# EAGLE design Osus-slave (EAGLE 5.11)
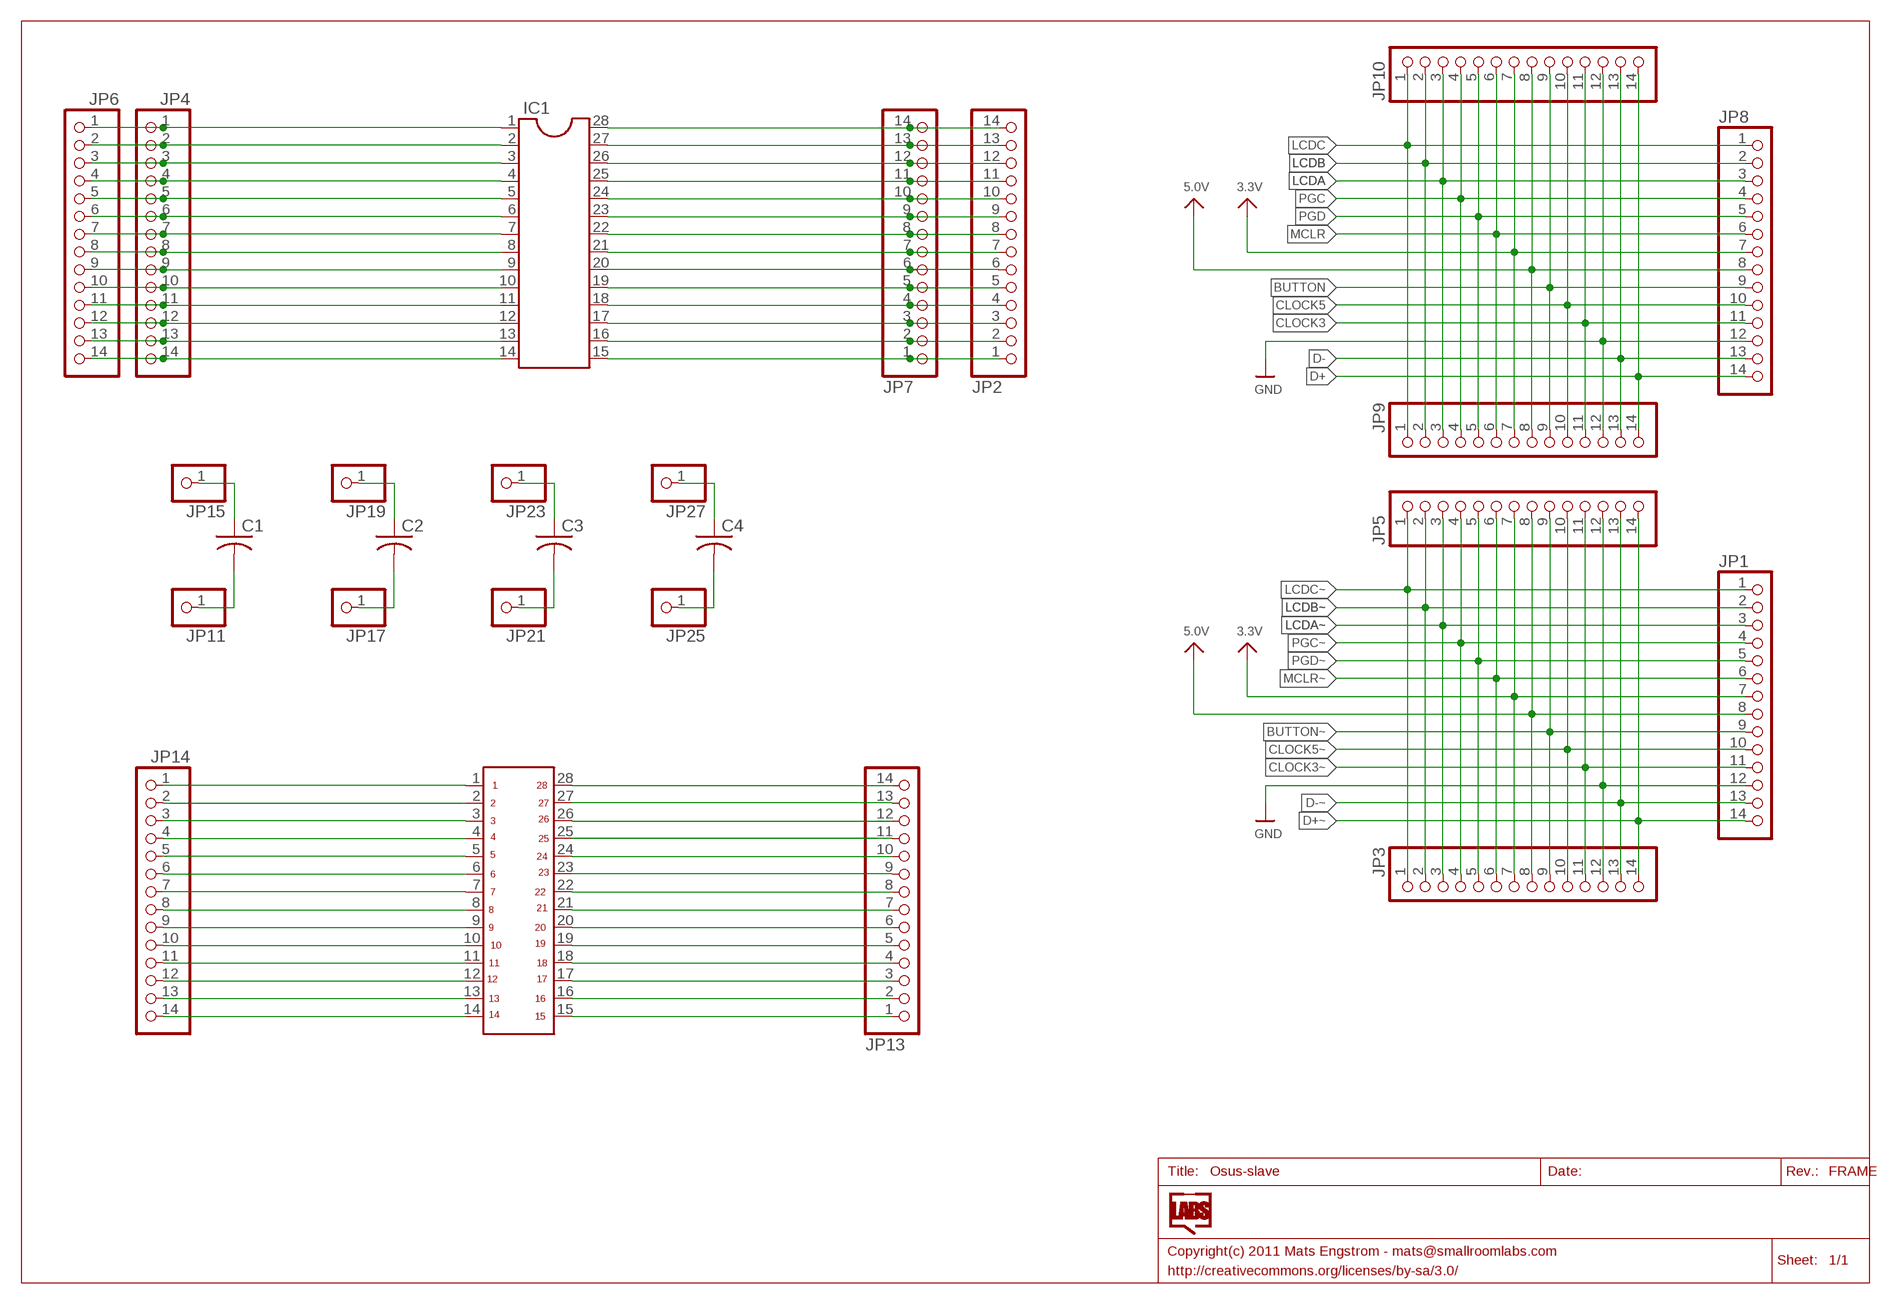
[diagram p0: schematic, sheet 1]

## Parts
C1  C-US050-025X075  [C050-025X075]
C2  C-US050-025X075  [C050-025X075]
C3  C-US050-025X075  [C050-025X075]
C4  C-US050-025X075  [C050-025X075]
IC1  DIL28-3  [DIL28-3]
JP1  PINHD-1X14  [1X14]
JP2  PINHD-1X14-CB  [1X14-CB]
JP3  PINHD-1X14-CB  [1X14-CB]
JP4  PINHD-1X14-CB  [1X14-CB]
JP5  PINHD-1X14-CB  [1X14-CB]
JP6  PINHD-1X14-CB  [1X14-CB]
JP7  PINHD-1X14-CB  [1X14-CB]
JP8  PINHD-1X14  [1X14]
JP9  PINHD-1X14-CB  [1X14-CB]
JP10  PINHD-1X14-CB  [1X14-CB]
JP11  PINHD-1X1  [1X01]
JP13  PINHD-1X14-CB  [1X14-CB]
JP14  PINHD-1X14-CB  [1X14-CB]
JP15  PINHD-1X1  [1X01]
JP17  PINHD-1X1  [1X01]
JP19  PINHD-1X1  [1X01]
JP21  PINHD-1X1  [1X01]
JP23  PINHD-1X1  [1X01]
JP25  PINHD-1X1  [1X01]
JP27  PINHD-1X1  [1X01]
U$6  IC28SOIC28-EXTRA  [SOIC127P1034X264-28N]

## Nets
3.3V: JP8.7 JP9.7 JP10.7
3.3V~: JP1.7 JP3.7 JP5.7 ; supply symbol labelled 3.3V
5.0V: JP8.8 JP9.8 JP10.8
5.0V~: JP1.8 JP3.8 JP5.8 ; supply symbol labelled 5.0V
BUTTON: JP8.9 JP9.9 JP10.9
BUTTON~: JP1.9 JP3.9 JP5.9
CLOCK3: JP8.11 JP9.11 JP10.11
CLOCK3~: JP1.11 JP3.11 JP5.11
CLOCK5: JP8.10 JP9.10 JP10.10
CLOCK5~: JP1.10 JP3.10 JP5.10
D+: JP8.14 JP9.14 JP10.14
D+~: JP1.14 JP3.14 JP5.14
D-: JP8.13 JP9.13 JP10.13
D-~: JP1.13 JP3.13 JP5.13
GND: JP8.12 JP9.12 JP10.12
GND~: JP1.12 JP3.12 JP5.12 ; supply symbol labelled GND
LCDA: JP8.3 JP9.3 JP10.3
LCDA~: JP1.3 JP3.3 JP5.3
LCDB: JP8.2 JP9.2 JP10.2
LCDB~: JP1.2 JP3.2 JP5.2
LCDC: JP8.1 JP9.1 JP10.1
LCDC~: JP1.1 JP3.1 JP5.1
MCLR: JP8.6 JP9.6 JP10.6
MCLR~: JP1.6 JP3.6 JP5.6
N$1: JP14.2 U$6.2
N$2: IC1.2 JP4.2 JP6.2
N$3: IC1.3 JP4.3 JP6.3
N$4: IC1.4 JP4.4 JP6.4
N$5: IC1.5 JP4.5 JP6.5
N$6: IC1.6 JP4.6 JP6.6
N$7: IC1.7 JP4.7 JP6.7
N$8: IC1.9 JP4.9 JP6.9
N$9: IC1.10 JP4.10 JP6.10
N$10: IC1.11 JP4.11 JP6.11
N$11: IC1.12 JP4.12 JP6.12
N$12: IC1.13 JP4.13 JP6.13
N$13: IC1.14 JP4.14 JP6.14
N$14: IC1.8 JP4.8 JP6.8
N$15: IC1.28 JP2.14 JP7.14
N$16: IC1.27 JP2.13 JP7.13
N$17: IC1.26 JP2.12 JP7.12
N$18: IC1.25 JP2.11 JP7.11
N$19: IC1.24 JP2.10 JP7.10
N$20: IC1.23 JP2.9 JP7.9
N$21: IC1.22 JP2.8 JP7.8
N$22: IC1.21 JP2.7 JP7.7
N$23: IC1.18 JP2.4 JP7.4
N$24: IC1.17 JP2.3 JP7.3
N$25: IC1.16 JP2.2 JP7.2
N$26: IC1.15 JP2.1 JP7.1
N$27: IC1.19 JP2.5 JP7.5
N$28: IC1.20 JP2.6 JP7.6
N$29: IC1.1 JP4.1 JP6.1
N$31: JP14.3 U$6.3
N$32: JP14.4 U$6.4
N$33: JP14.5 U$6.5
N$34: JP14.6 U$6.6
N$35: JP14.7 U$6.7
N$36: JP14.9 U$6.9
N$37: JP14.10 U$6.10
N$38: JP14.11 U$6.11
N$39: JP14.12 U$6.12
N$40: JP14.13 U$6.13
N$41: JP14.14 U$6.14
N$42: JP14.8 U$6.8
N$43: JP13.14 U$6.28
N$44: JP13.13 U$6.27
N$45: JP13.12 U$6.26
N$46: JP13.11 U$6.25
N$47: JP13.10 U$6.24
N$48: JP13.9 U$6.23
N$49: JP13.8 U$6.22
N$50: JP13.7 U$6.21
N$51: JP13.4 U$6.18
N$52: JP13.3 U$6.17
N$53: JP13.2 U$6.16
N$54: JP13.1 U$6.15
N$55: JP13.5 U$6.19
N$56: JP13.6 U$6.20
N$57: JP14.1 U$6.1
N$58: C1.1 JP15.1
N$59: C1.2 JP11.1
N$60: C2.1 JP19.1
N$61: C2.2 JP17.1
N$62: C3.1 JP23.1
N$63: C3.2 JP21.1
N$64: C4.1 JP27.1
N$65: C4.2 JP25.1
PGC: JP8.4 JP9.4 JP10.4
PGC~: JP1.4 JP3.4 JP5.4
PGD: JP8.5 JP9.5 JP10.5
PGD~: JP1.5 JP3.5 JP5.5

## Library data of the parts
C1-C4 = adafruit:C-US: CAPACITOR, American symbol
IC1 = ic-package:DIL28: Dual In Line
JP1 JP8 = pinhead:PINHD-1X14: PIN HEADER
JP2-JP7 JP9 JP10 JP13 JP14 = adafruit:PINHD-1X14: PIN HEADER
JP11 JP15 JP17 JP19 JP21 JP23 JP25 JP27 = adafruit:PINHD-1X1: Pin header 1x1 for 0.1" spacing With round pins
U$6 = SmallRoomLabs:IC28

## Net classes
0 default: width 0.203 mm, drill 0.305 mm, clearance 0.203 mm

## Board
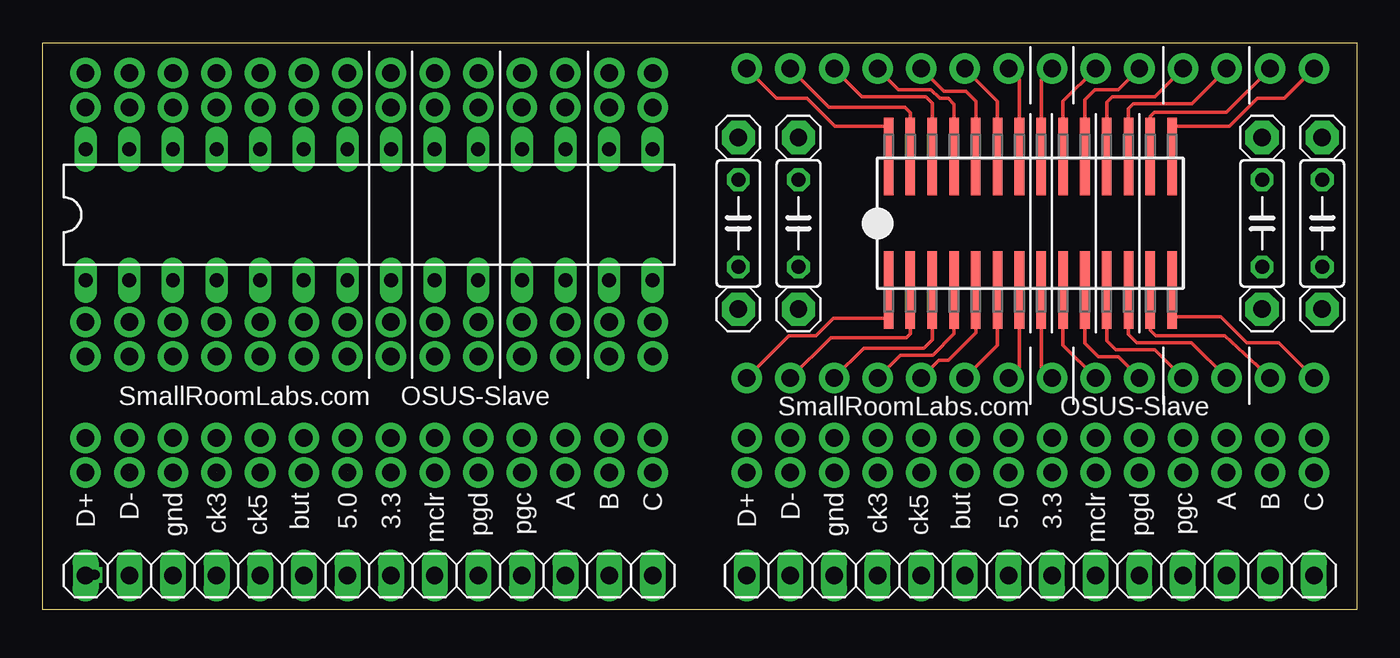
[diagram p1: board, top side]
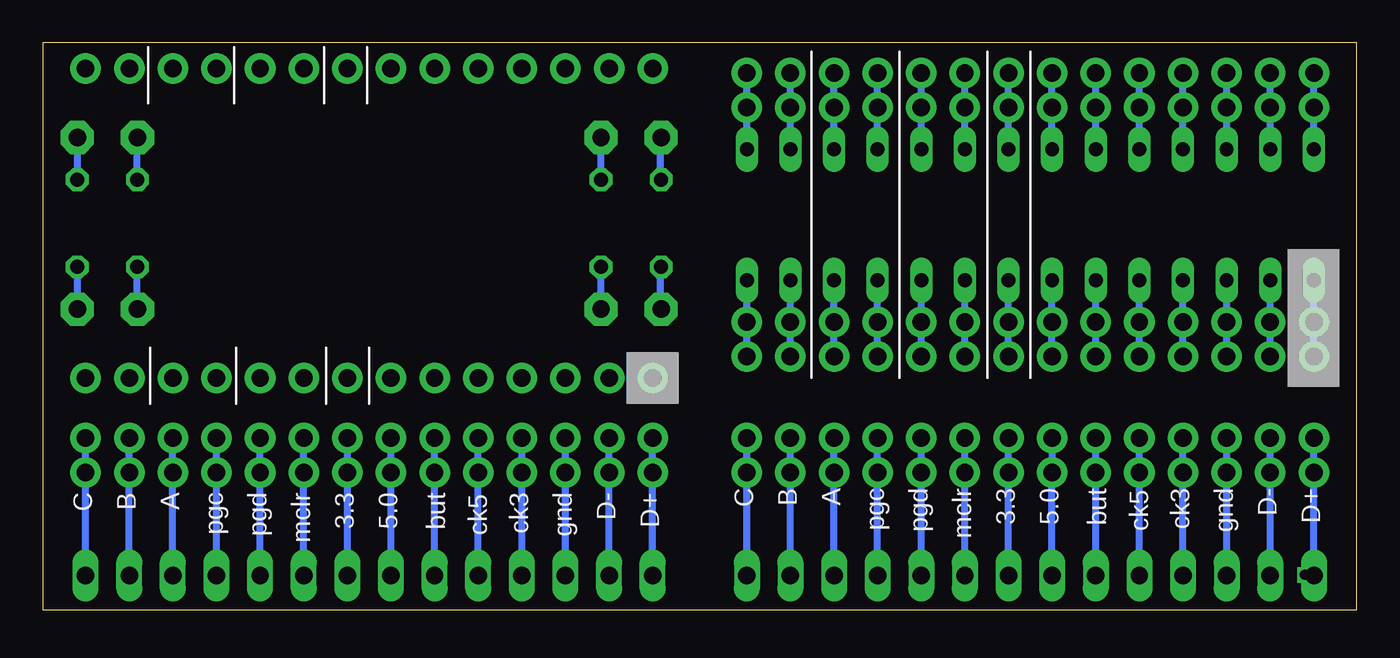
[diagram p2: board, bottom side, seen from below]

Size 76.5 x 33 mm. Coordinates in mm from the lower left corner, seen from the top.
Outline: 0,33 76.5,33 76.5,0 0,0 0,33
Copper layers (1*16): Top 0.035mm / dielectric 1.5mm / Bottom 0.035mm
Design rules "SmartPrototyping": minimum track width 7mil, minimum drill 12mil, track to track 7mil, track to pad 7mil, pad to pad 7mil, via to via 7mil, smd to smd 0mil, copper to edge 20mil, drill to drill 10mil, minimum pad ring 10mil, minimum via ring 6mil, stop-mask expansion 2mil, vias tented up to drill 25mil, thermal gap 10mil

### Footprints (pad centres in the part's own frame; a part is rotated, then mirrored left to right if it is on the bottom)
C050-025X075 = drill 0.813 octagon: 1 -2.54,0; 2 2.54,0
DIL28-3 = drill 0.813 long: 1 -16.51,-3.81; 2 -13.97,-3.81; 3 -11.43,-3.81; 4 -8.89,-3.81; 5 -6.35,-3.81; 6 -3.81,-3.81; 7 -1.27,-3.81; 8 1.27,-3.81; 9 3.81,-3.81; 10 6.35,-3.81; 11 8.89,-3.81; 12 11.43,-3.81; 13 13.97,-3.81; 14 16.51,-3.81; 15 16.51,3.81; 16 13.97,3.81; 17 11.43,3.81; 18 8.89,3.81; 19 6.35,3.81; 20 3.81,3.81; 21 1.27,3.81; 22 -1.27,3.81; 23 -3.81,3.81; 24 -6.35,3.81; 25 -8.89,3.81; 26 -11.43,3.81; 27 -13.97,3.81; 28 -16.51,3.81
1X14 = drill 1.016 long: 1 -16.51,0; 2 -13.97,0; 3 -11.43,0; 4 -8.89,0; 5 -6.35,0; 6 -3.81,0; 7 -1.27,0; 8 1.27,0; 9 3.81,0; 10 6.35,0; 11 8.89,0; 12 11.43,0; 13 13.97,0; 14 16.51,0
1X14-CB = drill 1.016 pad 1.778 round: 1 -16.51,0; 2 -13.97,0; 3 -11.43,0; 4 -8.89,0; 5 -6.35,0; 6 -3.81,0; 7 -1.27,0; 8 1.27,0; 9 3.81,0; 10 6.35,0; 11 8.89,0; 12 11.43,0; 13 13.97,0; 14 16.51,0
1X01 = drill 1.016 pad 1.93 octagon: 1 0,0
SOIC127P1034X264-28N = smd 4.521 x 0.559: 1 -3.886,8.255; 2 -3.886,6.985; 3 -3.886,5.715; 4 -3.886,4.445; 5 -3.886,3.175; 6 -3.886,1.905; 7 -3.886,0.635; 8 -3.886,-0.635; 9 -3.886,-1.905; 10 -3.886,-3.175; 11 -3.886,-4.445; 12 -3.886,-5.715; 13 -3.886,-6.985; 14 -3.886,-8.255; 15 3.886,-8.255; 16 3.886,-6.985; 17 3.886,-5.715; 18 3.886,-4.445; 19 3.886,-3.175; 20 3.886,-1.905; 21 3.886,-0.635; 22 3.886,0.635; 23 3.886,1.905; 24 3.886,3.175; 25 3.886,4.445; 26 3.886,5.715; 27 3.886,6.985; 28 3.886,8.255

### Placement (x,y rotation side)
C1  44,22.5 90 top
C2  40.5,22.5 90 top
C3  71,22.5 270 top
C4  74.5,22.5 90 top
IC1  19,23 0 top
JP1  19,2 180 top
JP2  19,29.25 180 top
JP3  19,10 180 top
JP4  19,14.75 0 top
JP5  19,8 180 top
JP6  19,16.75 0 top
JP7  19,31.25 180 top
JP8  57.5,2 0 top
JP9  57.5,8 0 top
JP10  57.5,10 0 top
JP11  44,27.5 0 top
JP13  57.5,31.5 180 top
JP14  57.5,13.5 0 top
JP15  44,17.5 0 top
JP17  40.5,27.5 0 top
JP19  40.5,17.5 0 top
JP21  71,17.5 0 top
JP23  71,27.5 0 top
JP25  74.5,27.5 0 top
JP27  74.5,17.5 0 top
U$6  57.5,22.5 90 top

### Tracks (layer width: path | path; a pad name or v marks a point on that pad's centre or on a via)
3.3V
  Bottom 0.406: JP10.7 JP9.7 JP8.7
3.3V~
  Bottom 0.406: JP1.7 JP5.7 JP3.7
5.0V
  Bottom 0.406: JP10.8 JP9.8 JP8.8
5.0V~  (via drill 0.6)  (1 unrouted)
  Bottom 0.406: JP3.8 JP5.8 JP1.8
  other vias: 17.73,8
BUTTON
  Bottom 0.406: JP10.9 JP9.9 JP8.9
BUTTON~
  Bottom 0.406: JP3.9 JP5.9 JP1.9
CLOCK3
  Bottom 0.406: JP10.11 JP9.11 JP8.11
CLOCK3~  (via drill 0.6)  (1 unrouted)
  Bottom 0.406: JP3.11 JP5.11 JP1.11
  other vias: 10.11,8
CLOCK5
  Bottom 0.406: JP10.10 JP9.10 JP8.10
CLOCK5~
  Bottom 0.406: JP1.10 JP5.10 JP3.10
D+
  Bottom 0.406: JP8.14 JP9.14 JP10.14
D+~  (via drill 0.6)
  Bottom 0.406: v3,2.04 3,2 JP1.14 JP5.14 JP3.14
D-
  Bottom 0.406: JP10.13 JP9.13 JP8.13
D-~  (via drill 0.6)  (1 unrouted)
  Bottom 0.406: JP3.13 JP5.13 JP1.13
  other vias: 5.03,8
GND
  Bottom 0.406: JP10.12 JP9.12 JP8.12
GND~
  Bottom 0.406: JP1.12 JP5.12 JP3.12
LCDA
  Bottom 0.406: JP10.3 JP9.3 JP8.3
LCDA~
  Bottom 0.406: JP3.3 JP5.3 JP1.3
LCDB
  Bottom 0.406: JP10.2 JP9.2 JP8.2
LCDB~
  Bottom 0.406: JP1.2 JP5.2 JP3.2
LCDC
  Bottom 0.406: JP10.1 JP9.1 JP8.1
LCDC~
  Bottom 0.406: JP3.1 JP5.1 JP1.1
MCLR
  Bottom 0.406: JP10.6 JP9.6 JP8.6
MCLR~
  Bottom 0.406: JP3.6 JP5.6 JP1.6
N$1
  Top 0.203: U$6.2 50.52,16.07 50.29,15.85 45.88,15.85 JP14.2
N$2
  Bottom 0.406: IC1.2 JP6.2 JP4.2
N$3
  Bottom 0.406: IC1.3 JP6.3 JP4.3
N$4
  Bottom 0.406: IC1.4 JP6.4 JP4.4
N$5
  Bottom 0.406: IC1.5 JP6.5 JP4.5
N$6
  Bottom 0.406: IC1.6 JP6.6 JP4.6
N$7
  Bottom 0.406: IC1.7 JP6.7 JP4.7
N$8
  Bottom 0.406: IC1.9 JP6.9 JP4.9
N$9
  Bottom 0.406: IC1.10 JP6.10 JP4.10
N$10
  Bottom 0.406: IC1.11 JP6.11 JP4.11
N$11
  Bottom 0.406: IC1.12 JP6.12 JP4.12
N$12
  Bottom 0.406: IC1.13 JP6.13 JP4.13
N$13
  Bottom 0.406: IC1.14 JP6.14 JP4.14
N$14
  Bottom 0.406: IC1.8 JP6.8 JP4.8
N$15
  Bottom 0.406: IC1.28 JP2.14 JP7.14
N$16
  Bottom 0.406: IC1.27 JP2.13 JP7.13
N$17
  Bottom 0.406: IC1.26 JP2.12 JP7.12
N$18
  Bottom 0.406: IC1.25 JP2.11 JP7.11
N$19
  Bottom 0.406: IC1.24 JP2.10 JP7.10
N$20
  Bottom 0.406: IC1.23 JP2.9 JP7.9
N$21
  Bottom 0.406: IC1.22 JP2.8 JP7.8
N$22
  Bottom 0.406: IC1.21 JP2.7 JP7.7
N$23
  Bottom 0.406: IC1.18 JP2.4 JP7.4
N$24
  Bottom 0.406: IC1.17 JP2.3 JP7.3
N$25
  Bottom 0.406: IC1.16 JP2.2 JP7.2
N$26
  Bottom 0.406: IC1.15 JP2.1 JP7.1
N$27
  Bottom 0.406: IC1.19 JP2.5 JP7.5
N$28
  Bottom 0.406: IC1.20 JP2.6 JP7.6
N$29
  Bottom 0.406: IC1.1 JP6.1 JP4.1
N$31
  Top 0.203: U$6.3 51.78,15.72 51.31,15.24 47.81,15.24 JP14.3
N$32
  Top 0.203: U$6.4 53.05,16.07 51.82,14.83 49.94,14.83 JP14.4
N$33
  Top 0.203: U$6.5 54.33,16.12 52.73,14.53 52.18,14.53 JP14.5
N$34
  Top 0.203: U$6.6 55.59,15.4 JP14.6
N$35
  Top 0.203: U$6.7 56.87,14.13 JP14.7
N$36
  Top 0.203: U$6.9 59.41,15.4 JP14.9
N$37
  Top 0.203: U$6.10 60.67,15.53 61.47,14.73 62.62,14.73 JP14.10
N$38
  Top 0.203: U$6.11 61.95,15.68 62.48,15.14 64.75,15.14 JP14.11
N$39
  Top 0.203: U$6.12 63.22,16.03 63.7,15.54 66.89,15.54 JP14.12
N$40
  Top 0.203: U$6.13 64.48,16.29 64.82,15.95 68.82,15.95 JP14.13
N$41
  Top 0.203: U$6.14 65.75,17.15 65.84,17.07 68.58,17.07 70.1,15.54 71.97,15.54 JP14.14
N$42
  Top 0.203: U$6.8 58.13,14.13 JP14.8
N$43
  Top 0.203: U$6.28 49.24,28.07 49.17,28.14 46.13,28.14 44.5,29.77 42.72,29.77 JP13.14
N$44
  Top 0.203: U$6.27 50.52,28.94 50.19,29.26 45.77,29.26 JP13.13
N$45
  Top 0.203: U$6.26 51.78,29.5 51.41,29.87 47.7,29.87 JP13.12
N$46
  Top 0.203: U$6.25 53.05,29.44 52.73,29.77 52.22,29.77 51.71,30.28 49.83,30.28 JP13.11
N$47
  Top 0.203: U$6.24 54.33,29.6 53.75,30.18 52.48,30.18 JP13.10
N$48
  Top 0.203: U$6.23 55.59,29.59 JP13.9
N$49
  Top 0.203: U$6.22 56.87,30.86 JP13.8
N$50
  Top 0.203: U$6.21 58.13,30.86 JP13.7
N$51
  Top 0.203: U$6.18 61.95,29.54 62.28,29.87 64.76,29.87 JP13.4
N$52
  Top 0.203: U$6.17 63.22,29.18 63.5,29.46 66.89,29.46 JP13.3
N$53
  Top 0.203: U$6.16 64.48,28.72 64.72,28.96 68.93,28.96 JP13.2
N$54
  Top 0.203: U$6.15 65.75,28.12 65.73,28.14 69.09,28.14 70.71,29.77 72.28,29.77 JP13.1
N$55
  Top 0.203: U$6.19 60.67,29.69 61.27,30.28 62.63,30.28 JP13.5
N$56
  Top 0.203: U$6.20 59.41,29.59 JP13.6
N$57
  Top 0.203: U$6.1 49.24,17.04 49.17,16.97 46.02,16.97 45.01,15.95 43.44,15.95 JP14.1
N$58
  Bottom 0.406: C1.1 43.99,19.91 43.99,17.58 JP15.1
N$59
  Bottom 0.406: C1.2 43.99,25.09 43.99,27.43 JP11.1
N$60
  Bottom 0.406: C2.1 40.54,19.91 40.54,17.58 JP19.1
N$61
  Bottom 0.406: C2.2 40.54,25.09 40.54,27.43 JP17.1
N$62
  Bottom 0.406: C3.1 71.02,25.09 71.02,27.43 JP23.1
N$63
  Bottom 0.406: C3.2 71.02,19.91 71.02,17.58 JP21.1
N$64
  Bottom 0.406: C4.1 74.47,19.91 74.47,17.58 JP27.1
N$65
  Bottom 0.406: C4.2 74.47,25.09 74.47,27.43 JP25.1
PGC
  Bottom 0.406: JP10.4 JP9.4 JP8.4
PGC~
  Bottom 0.406: JP1.4 JP5.4 JP3.4
PGD
  Bottom 0.406: JP10.5 JP9.5 JP8.5
PGD~
  Bottom 0.406: JP1.5 JP5.5 JP3.5

### Text on the board
tPlace: SmallRoomLabs.com OSUS-Slave | SmallRoomLabs.com OSUS-Slave | D+ | D- | gnd | ck3 | ck5 | but | 5.0 | 3.3 | mclr | pgd | pgc | A | B | C | D+ | D- | gnd | ck3 | ck5 | but | 5.0 | 3.3 | mclr | pgd | pgc | A | B | C
bPlace: D+ | D- | gnd | ck3 | ck5 | but | 5.0 | 3.3 | mclr | pgd | pgc | A | B | C | D+ | D- | gnd | ck3 | ck5 | but | 5.0 | 3.3 | mclr | pgd | pgc | A | B | C